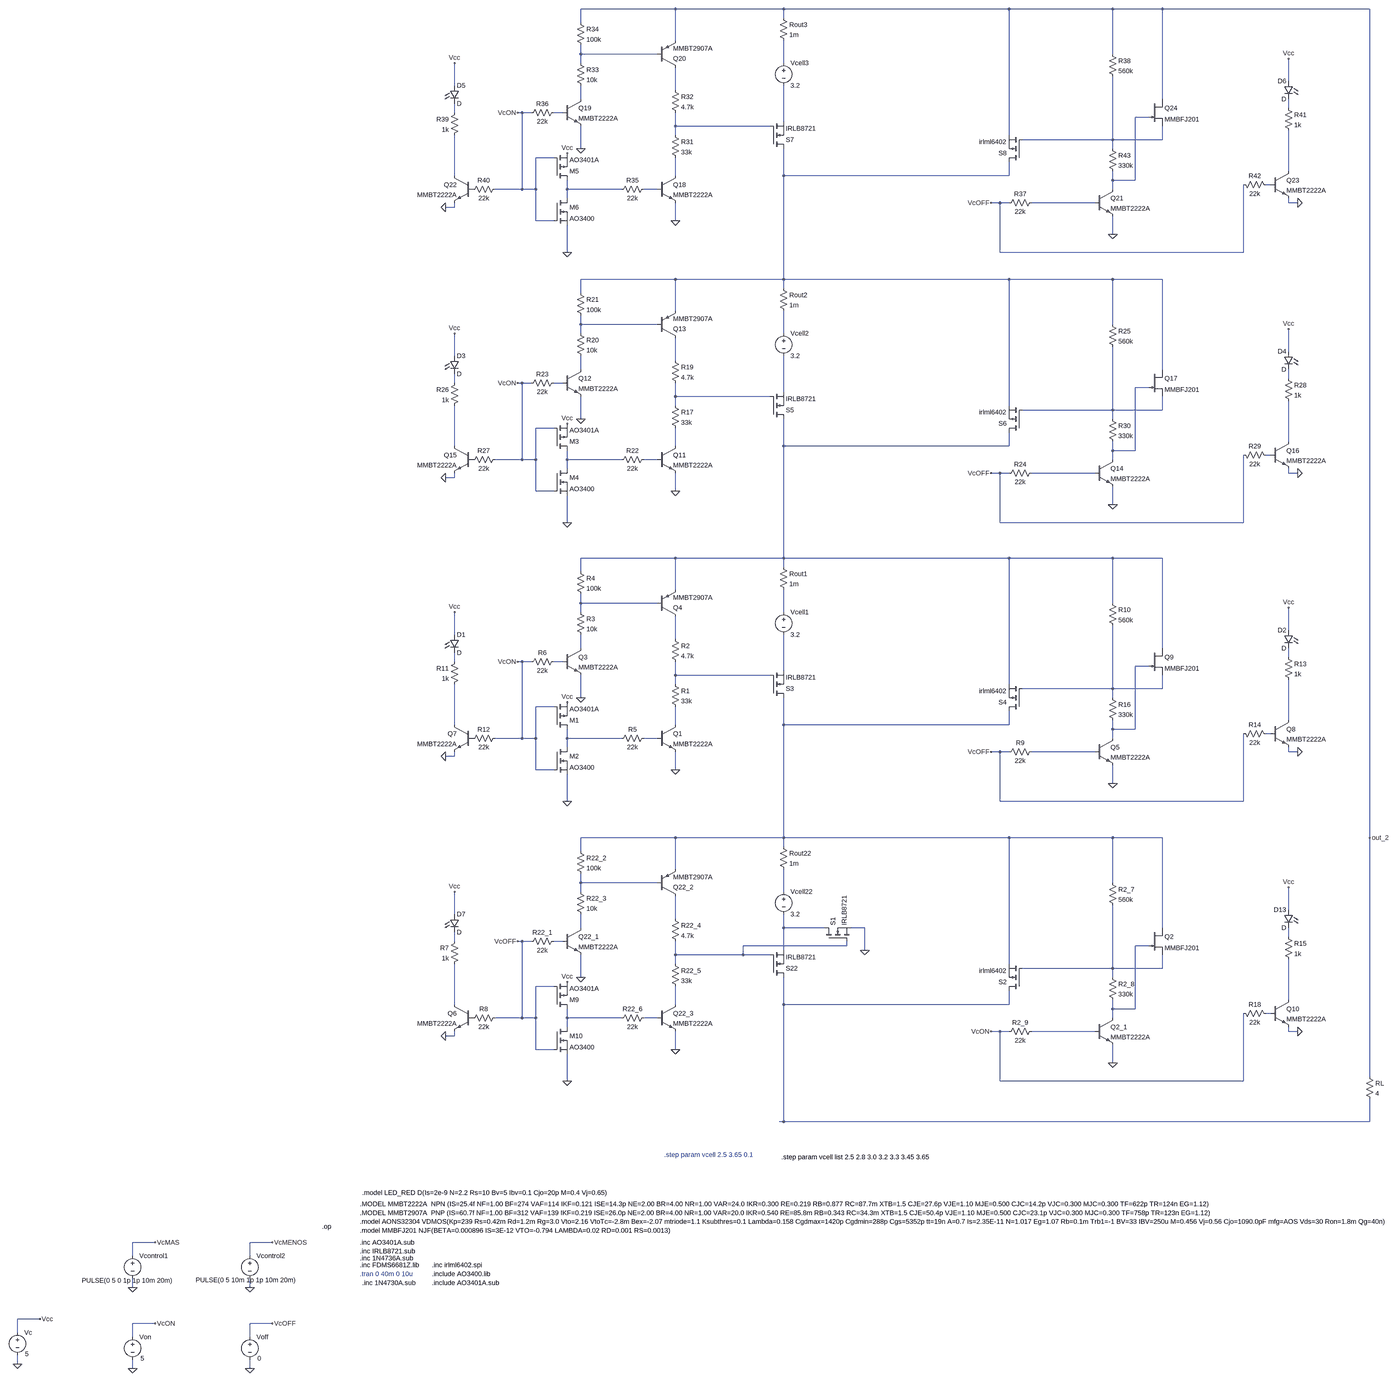
[diagram p0: schematic Testeo de cell_neg.asc, whole sheet]
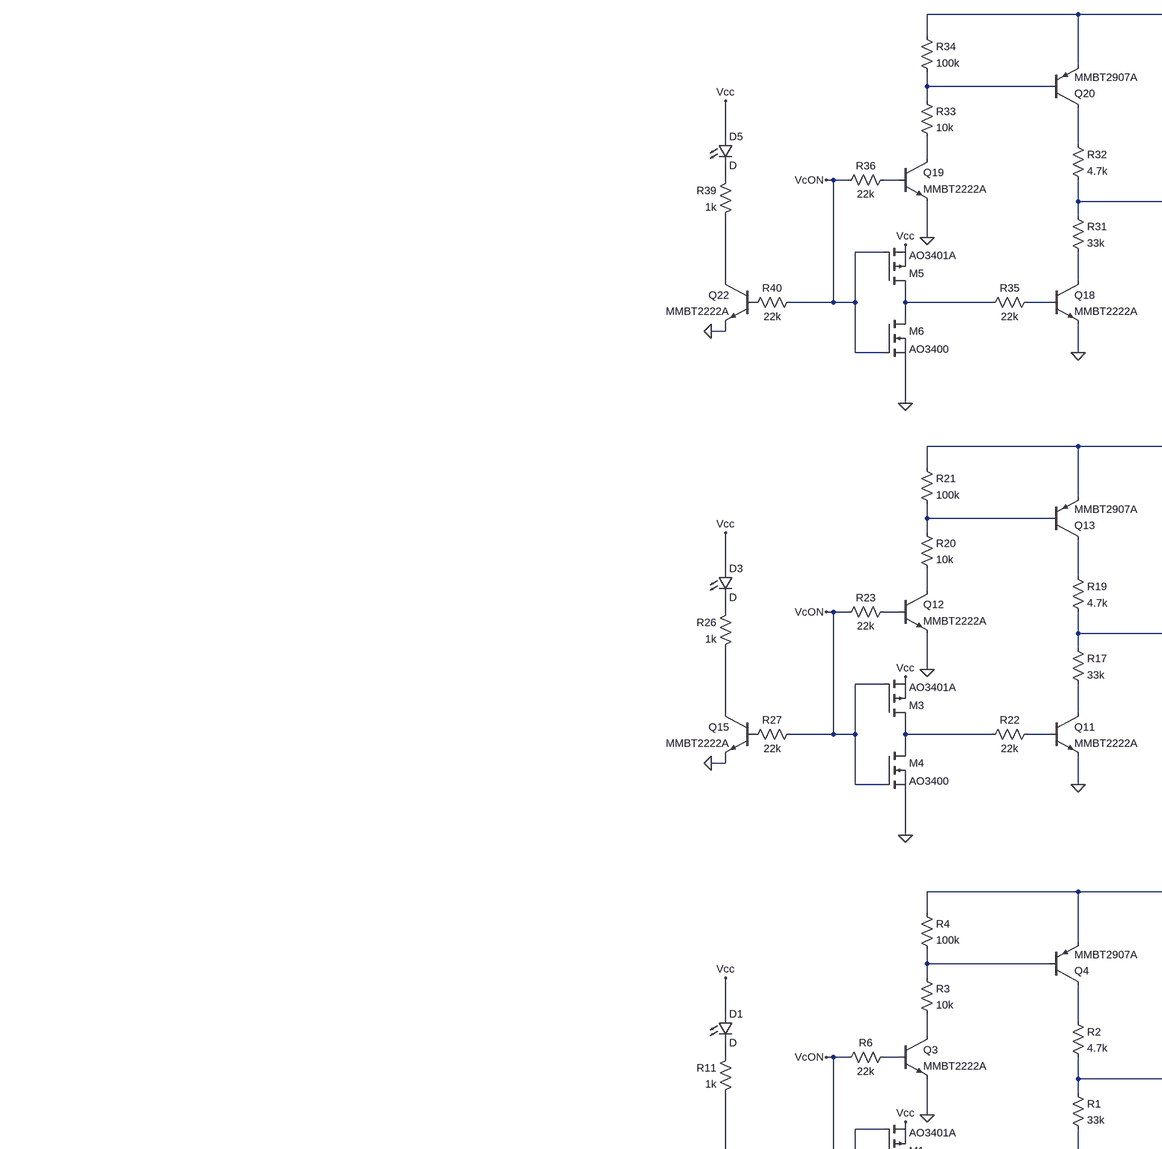
[diagram p1: schematic Testeo de cell_neg.asc, part, row 1 of 2, column 1 of 2]
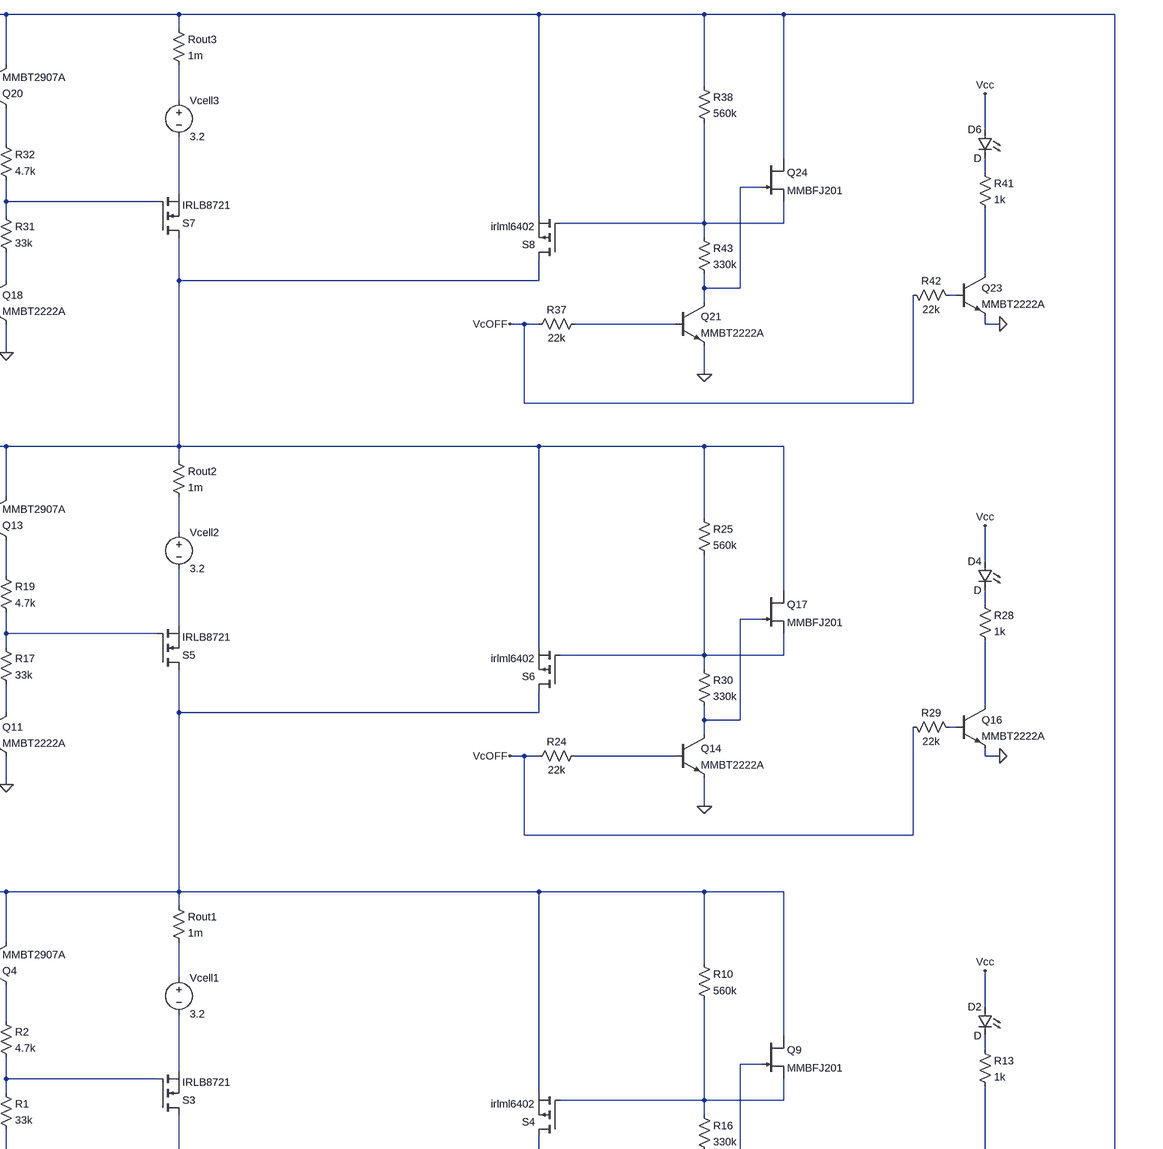
[diagram p2: schematic Testeo de cell_neg.asc, part, row 1 of 2, column 2 of 2]
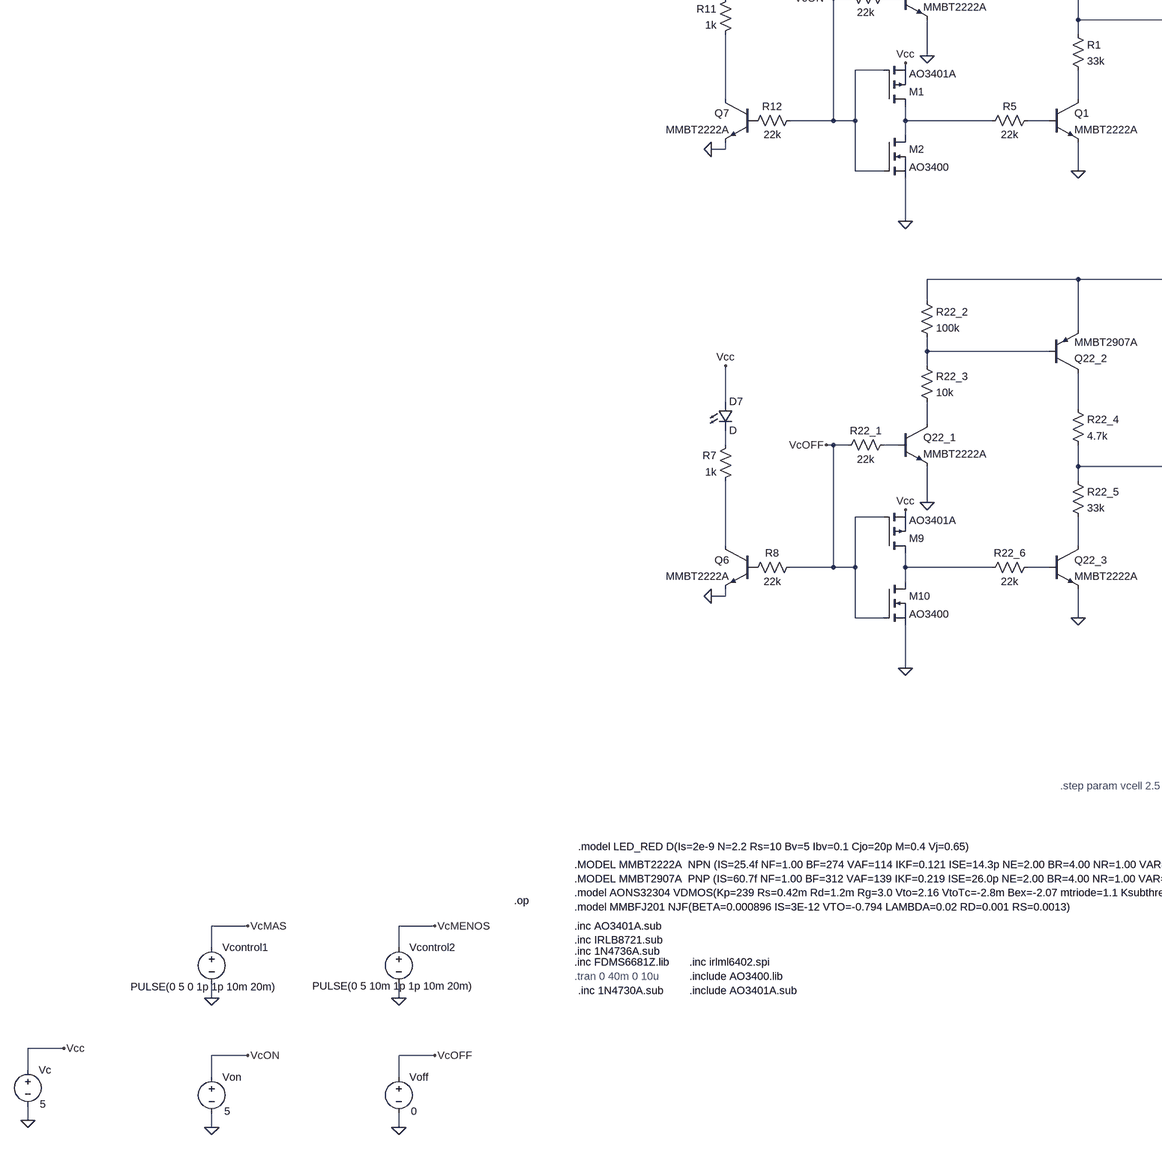
[diagram p3: schematic Testeo de cell_neg.asc, part, row 2 of 2, column 1 of 2]
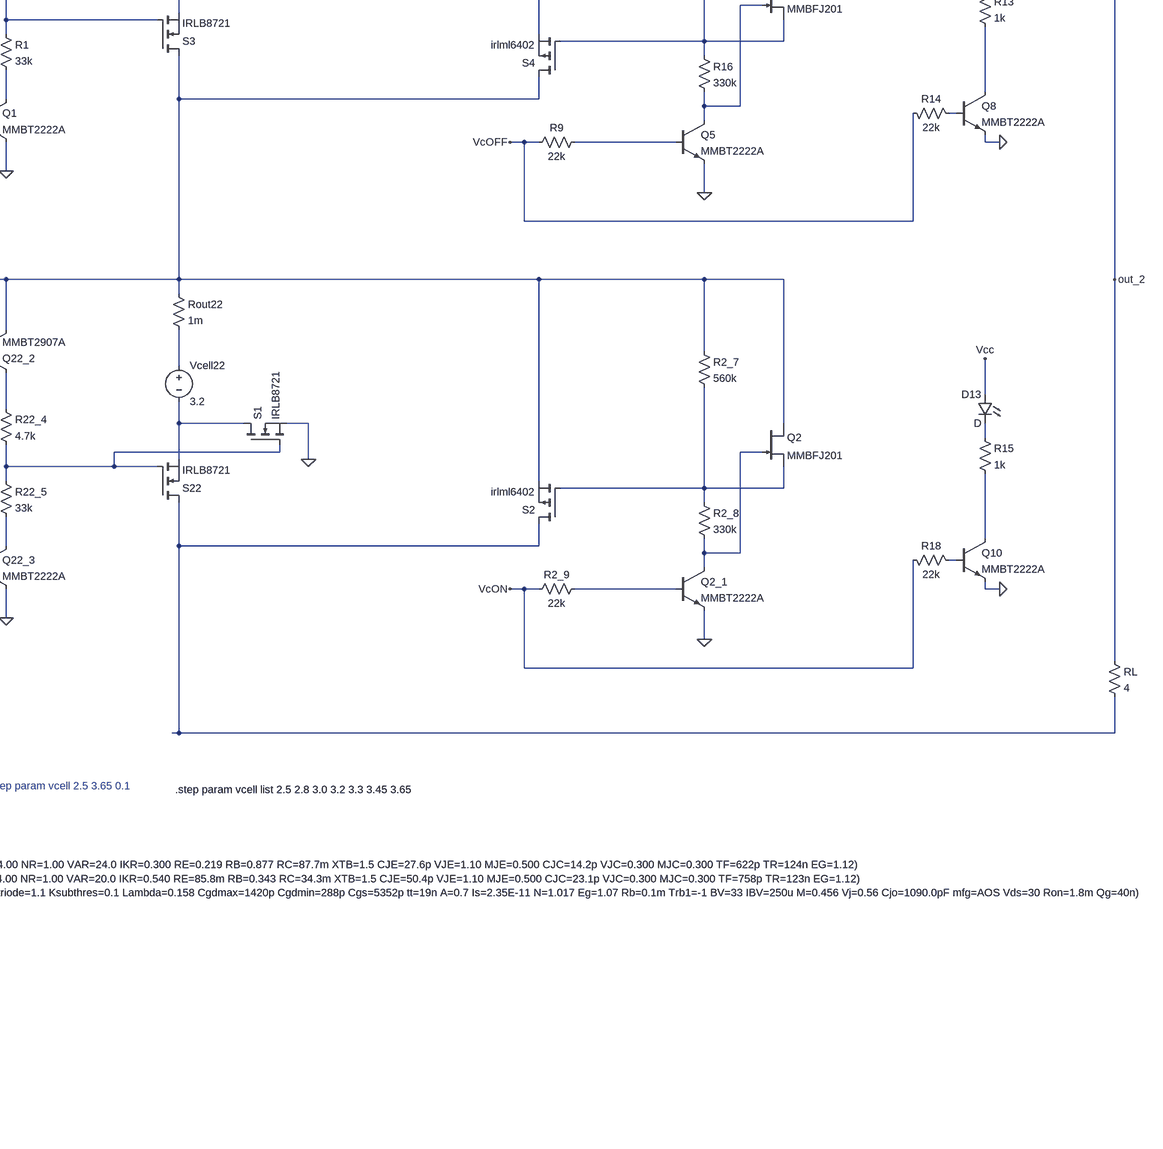
[diagram p4: schematic Testeo de cell_neg.asc, part, row 2 of 2, column 2 of 2]
Testeo de cell_neg.asc, the LTspice schematic file:
Version 4.1
SHEET 1 7672 2128
WIRE 896 -3664 560 -3664
WIRE 1280 -3664 896 -3664
WIRE 2080 -3664 1280 -3664
WIRE 2448 -3664 2080 -3664
WIRE 2624 -3664 2448 -3664
WIRE 3360 -3664 2624 -3664
WIRE 1280 -3632 1280 -3664
WIRE 560 -3616 560 -3664
WIRE 896 -3552 896 -3664
WIRE 560 -3504 560 -3536
WIRE 832 -3504 560 -3504
WIRE 2448 -3504 2448 -3664
WIRE 560 -3472 560 -3504
WIRE 1280 -3472 1280 -3552
WIRE 3072 -3408 3072 -3488
WIRE 112 -3392 112 -3472
WIRE 896 -3376 896 -3456
WIRE 560 -3344 560 -3392
WIRE 2624 -3344 2624 -3664
WIRE 3072 -3312 3072 -3344
WIRE 112 -3296 112 -3328
WIRE 352 -3296 336 -3296
WIRE 384 -3296 352 -3296
WIRE 496 -3296 464 -3296
WIRE 2576 -3280 2528 -3280
WIRE 1280 -3264 1280 -3392
WIRE 896 -3248 896 -3296
WIRE 1232 -3248 896 -3248
WIRE 896 -3216 896 -3248
WIRE 2080 -3216 2080 -3664
WIRE 2448 -3200 2448 -3424
WIRE 2448 -3200 2128 -3200
WIRE 2624 -3200 2624 -3248
WIRE 2624 -3200 2448 -3200
WIRE 560 -3168 560 -3248
WIRE 2448 -3168 2448 -3200
WIRE 464 -3136 400 -3136
WIRE 3072 -3088 3072 -3232
WIRE 112 -3072 112 -3216
WIRE 896 -3072 896 -3136
WIRE 1280 -3072 1280 -3168
WIRE 2080 -3072 2080 -3120
WIRE 2080 -3072 1280 -3072
WIRE 2448 -3056 2448 -3088
WIRE 2528 -3056 2528 -3280
WIRE 2528 -3056 2448 -3056
WIRE 3008 -3040 2992 -3040
WIRE 352 -3024 352 -3296
WIRE 352 -3024 256 -3024
WIRE 400 -3024 400 -3136
WIRE 400 -3024 352 -3024
WIRE 512 -3024 512 -3056
WIRE 704 -3024 512 -3024
WIRE 832 -3024 784 -3024
WIRE 2448 -3024 2448 -3056
WIRE 512 -2992 512 -3024
WIRE 2048 -2976 2016 -2976
WIRE 2080 -2976 2048 -2976
WIRE 2384 -2976 2160 -2976
WIRE 3072 -2976 3072 -2992
WIRE 3104 -2976 3072 -2976
WIRE 112 -2960 112 -2976
WIRE 112 -2960 80 -2960
WIRE 400 -2912 400 -3024
WIRE 464 -2912 400 -2912
WIRE 896 -2912 896 -2976
WIRE 2448 -2864 2448 -2928
WIRE 512 -2800 512 -2896
WIRE 2048 -2800 2048 -2976
WIRE 2912 -2800 2912 -3040
WIRE 2912 -2800 2048 -2800
WIRE 896 -2704 560 -2704
WIRE 1280 -2704 1280 -3072
WIRE 1280 -2704 896 -2704
WIRE 2080 -2704 1280 -2704
WIRE 2448 -2704 2080 -2704
WIRE 2624 -2704 2448 -2704
WIRE 1280 -2672 1280 -2704
WIRE 560 -2656 560 -2704
WIRE 896 -2592 896 -2704
WIRE 560 -2544 560 -2576
WIRE 832 -2544 560 -2544
WIRE 2448 -2544 2448 -2704
WIRE 560 -2512 560 -2544
WIRE 1280 -2512 1280 -2592
WIRE 3072 -2448 3072 -2528
WIRE 112 -2432 112 -2512
WIRE 896 -2416 896 -2496
WIRE 560 -2384 560 -2432
WIRE 2624 -2384 2624 -2704
WIRE 3072 -2352 3072 -2384
WIRE 112 -2336 112 -2368
WIRE 352 -2336 336 -2336
WIRE 384 -2336 352 -2336
WIRE 496 -2336 464 -2336
WIRE 2576 -2320 2528 -2320
WIRE 1280 -2304 1280 -2432
WIRE 896 -2288 896 -2336
WIRE 1232 -2288 896 -2288
WIRE 896 -2256 896 -2288
WIRE 2080 -2256 2080 -2704
WIRE 2448 -2240 2448 -2464
WIRE 2448 -2240 2128 -2240
WIRE 2624 -2240 2624 -2288
WIRE 2624 -2240 2448 -2240
WIRE 560 -2208 560 -2288
WIRE 2448 -2208 2448 -2240
WIRE 464 -2176 400 -2176
WIRE 3072 -2128 3072 -2272
WIRE 112 -2112 112 -2256
WIRE 896 -2112 896 -2176
WIRE 1280 -2112 1280 -2208
WIRE 2080 -2112 2080 -2160
WIRE 2080 -2112 1280 -2112
WIRE 2448 -2096 2448 -2128
WIRE 2528 -2096 2528 -2320
WIRE 2528 -2096 2448 -2096
WIRE 3008 -2080 2992 -2080
WIRE 352 -2064 352 -2336
WIRE 352 -2064 256 -2064
WIRE 400 -2064 400 -2176
WIRE 400 -2064 352 -2064
WIRE 512 -2064 512 -2096
WIRE 704 -2064 512 -2064
WIRE 832 -2064 784 -2064
WIRE 2448 -2064 2448 -2096
WIRE 512 -2032 512 -2064
WIRE 2048 -2016 2016 -2016
WIRE 2080 -2016 2048 -2016
WIRE 2384 -2016 2160 -2016
WIRE 3072 -2016 3072 -2032
WIRE 3104 -2016 3072 -2016
WIRE 112 -2000 112 -2016
WIRE 112 -2000 80 -2000
WIRE 400 -1952 400 -2064
WIRE 464 -1952 400 -1952
WIRE 896 -1952 896 -2016
WIRE 2448 -1904 2448 -1968
WIRE 512 -1840 512 -1936
WIRE 2048 -1840 2048 -2016
WIRE 2912 -1840 2912 -2080
WIRE 2912 -1840 2048 -1840
WIRE 896 -1696 560 -1696
WIRE 1280 -1696 1280 -2112
WIRE 1280 -1696 896 -1696
WIRE 2080 -1696 1280 -1696
WIRE 2448 -1696 2080 -1696
WIRE 2624 -1696 2448 -1696
WIRE 1280 -1664 1280 -1696
WIRE 560 -1648 560 -1696
WIRE 896 -1584 896 -1696
WIRE 560 -1536 560 -1568
WIRE 832 -1536 560 -1536
WIRE 2448 -1536 2448 -1696
WIRE 560 -1504 560 -1536
WIRE 1280 -1504 1280 -1584
WIRE 3072 -1440 3072 -1520
WIRE 112 -1424 112 -1504
WIRE 896 -1408 896 -1488
WIRE 560 -1376 560 -1424
WIRE 2624 -1376 2624 -1696
WIRE 3072 -1344 3072 -1376
WIRE 112 -1328 112 -1360
WIRE 352 -1328 336 -1328
WIRE 384 -1328 352 -1328
WIRE 496 -1328 464 -1328
WIRE 2576 -1312 2528 -1312
WIRE 1280 -1296 1280 -1424
WIRE 896 -1280 896 -1328
WIRE 1232 -1280 896 -1280
WIRE 896 -1248 896 -1280
WIRE 2080 -1248 2080 -1696
WIRE 2448 -1232 2448 -1456
WIRE 2448 -1232 2128 -1232
WIRE 2624 -1232 2624 -1280
WIRE 2624 -1232 2448 -1232
WIRE 560 -1200 560 -1280
WIRE 2448 -1200 2448 -1232
WIRE 464 -1168 400 -1168
WIRE 3072 -1120 3072 -1264
WIRE 112 -1104 112 -1248
WIRE 896 -1104 896 -1168
WIRE 1280 -1104 1280 -1200
WIRE 2080 -1104 2080 -1152
WIRE 2080 -1104 1280 -1104
WIRE 2448 -1088 2448 -1120
WIRE 2528 -1088 2528 -1312
WIRE 2528 -1088 2448 -1088
WIRE 3008 -1072 2992 -1072
WIRE 352 -1056 352 -1328
WIRE 352 -1056 256 -1056
WIRE 400 -1056 400 -1168
WIRE 400 -1056 352 -1056
WIRE 512 -1056 512 -1088
WIRE 704 -1056 512 -1056
WIRE 832 -1056 784 -1056
WIRE 2448 -1056 2448 -1088
WIRE 512 -1024 512 -1056
WIRE 2048 -1008 2016 -1008
WIRE 2080 -1008 2048 -1008
WIRE 2384 -1008 2160 -1008
WIRE 3072 -1008 3072 -1024
WIRE 3104 -1008 3072 -1008
WIRE 112 -992 112 -1008
WIRE 112 -992 80 -992
WIRE 400 -944 400 -1056
WIRE 464 -944 400 -944
WIRE 896 -944 896 -1008
WIRE 2448 -896 2448 -960
WIRE 512 -832 512 -928
WIRE 2048 -832 2048 -1008
WIRE 2912 -832 2912 -1072
WIRE 2912 -832 2048 -832
WIRE 896 -688 560 -688
WIRE 1280 -688 1280 -1104
WIRE 1280 -688 896 -688
WIRE 2080 -688 1280 -688
WIRE 2448 -688 2080 -688
WIRE 2624 -688 2448 -688
WIRE 3360 -688 3360 -3664
WIRE 1280 -656 1280 -688
WIRE 560 -640 560 -688
WIRE 896 -576 896 -688
WIRE 560 -528 560 -560
WIRE 832 -528 560 -528
WIRE 2448 -528 2448 -688
WIRE 560 -496 560 -528
WIRE 1280 -496 1280 -576
WIRE 3072 -432 3072 -512
WIRE 112 -416 112 -496
WIRE 896 -400 896 -480
WIRE 560 -368 560 -416
WIRE 1280 -368 1280 -416
WIRE 1424 -368 1280 -368
WIRE 1568 -368 1520 -368
WIRE 2624 -368 2624 -688
WIRE 3072 -336 3072 -368
WIRE 112 -320 112 -352
WIRE 352 -320 336 -320
WIRE 384 -320 352 -320
WIRE 496 -320 464 -320
WIRE 1504 -304 1504 -320
WIRE 1504 -304 1136 -304
WIRE 2576 -304 2528 -304
WIRE 1280 -288 1280 -368
WIRE 1568 -288 1568 -368
WIRE 896 -272 896 -320
WIRE 1136 -272 1136 -304
WIRE 1136 -272 896 -272
WIRE 1232 -272 1136 -272
WIRE 896 -240 896 -272
WIRE 2080 -240 2080 -688
WIRE 2448 -224 2448 -448
WIRE 2448 -224 2128 -224
WIRE 2624 -224 2624 -272
WIRE 2624 -224 2448 -224
WIRE 560 -192 560 -272
WIRE 2448 -192 2448 -224
WIRE 464 -160 400 -160
WIRE 3072 -112 3072 -256
WIRE 112 -96 112 -240
WIRE 896 -96 896 -160
WIRE 1280 -96 1280 -192
WIRE 2080 -96 2080 -144
WIRE 2080 -96 1280 -96
WIRE 2448 -80 2448 -112
WIRE 2528 -80 2528 -304
WIRE 2528 -80 2448 -80
WIRE 3008 -64 2992 -64
WIRE 352 -48 352 -320
WIRE 352 -48 256 -48
WIRE 400 -48 400 -160
WIRE 400 -48 352 -48
WIRE 512 -48 512 -80
WIRE 704 -48 512 -48
WIRE 832 -48 784 -48
WIRE 2448 -48 2448 -80
WIRE 512 -16 512 -48
WIRE 2048 0 2016 0
WIRE 2080 0 2048 0
WIRE 2384 0 2160 0
WIRE 3072 0 3072 -16
WIRE 3104 0 3072 0
WIRE 112 16 112 0
WIRE 112 16 80 16
WIRE 400 64 400 -48
WIRE 464 64 400 64
WIRE 896 64 896 0
WIRE 2448 112 2448 48
WIRE 3360 160 3360 -688
WIRE 512 176 512 80
WIRE 2048 176 2048 0
WIRE 2912 176 2912 -64
WIRE 2912 176 2048 176
WIRE 1280 320 1280 -96
WIRE 1280 320 1264 320
WIRE 3360 320 3360 240
WIRE 3360 320 1280 320
WIRE -1072 1024 -1152 1024
WIRE -656 1024 -736 1024
WIRE -1152 1072 -1152 1024
WIRE -736 1072 -736 1024
WIRE -1152 1184 -1152 1152
WIRE -736 1184 -736 1152
WIRE -1504 1296 -1584 1296
WIRE -1072 1312 -1152 1312
WIRE -656 1312 -736 1312
WIRE -1584 1344 -1584 1296
WIRE -1152 1360 -1152 1312
WIRE -736 1360 -736 1312
WIRE -1584 1456 -1584 1424
WIRE -1152 1472 -1152 1440
WIRE -736 1472 -736 1440
FLAG 560 -192 0
FLAG 896 64 0
FLAG -1152 1184 0
FLAG -736 1184 0
FLAG -1072 1024 VcMAS
FLAG -656 1024 VcMENOS
FLAG -736 1472 0
FLAG -656 1312 VcOFF
FLAG -1152 1472 0
FLAG -1072 1312 VcON
FLAG 336 -320 VcOFF
FLAG 2448 112 0
FLAG 2016 0 VcON
FLAG 3360 -688 out_2
FLAG 80 16 0
FLAG 3104 0 0
FLAG 112 -496 Vcc
FLAG 3072 -512 Vcc
FLAG -1584 1456 0
FLAG -1504 1296 Vcc
FLAG 512 176 0
FLAG 512 -176 Vcc
FLAG 1568 -288 0
FLAG 560 -1200 0
FLAG 896 -944 0
FLAG 336 -1328 VcON
FLAG 2448 -896 0
FLAG 2016 -1008 VcOFF
FLAG 80 -992 0
FLAG 3104 -1008 0
FLAG 112 -1504 Vcc
FLAG 3072 -1520 Vcc
FLAG 512 -832 0
FLAG 512 -1184 Vcc
FLAG 560 -2208 0
FLAG 896 -1952 0
FLAG 336 -2336 VcON
FLAG 2448 -1904 0
FLAG 2016 -2016 VcOFF
FLAG 80 -2000 0
FLAG 3104 -2016 0
FLAG 112 -2512 Vcc
FLAG 3072 -2528 Vcc
FLAG 512 -1840 0
FLAG 512 -2192 Vcc
FLAG 560 -3168 0
FLAG 896 -2912 0
FLAG 336 -3296 VcON
FLAG 2448 -2864 0
FLAG 2016 -2976 VcOFF
FLAG 80 -2960 0
FLAG 3104 -2976 0
FLAG 112 -3472 Vcc
FLAG 3072 -3488 Vcc
FLAG 512 -2800 0
FLAG 512 -3152 Vcc
SYMBOL npn 832 -96 R0
SYMATTR InstName Q22_3
SYMATTR Value MMBT2222A
SYMBOL res 880 -256 R0
SYMATTR InstName R22_5
SYMATTR Value 33k
SYMBOL res 880 -416 R0
SYMATTR InstName R22_4
SYMATTR Value 4.7k
SYMBOL npn 496 -368 R0
SYMATTR InstName Q22_1
SYMATTR Value MMBT2222A
SYMBOL res 544 -512 R0
SYMATTR InstName R22_3
SYMATTR Value 10k
SYMBOL res 544 -656 R0
SYMATTR InstName R22_2
SYMATTR Value 100k
SYMBOL res 800 -64 R90
WINDOW 0 0 56 VBottom 2
WINDOW 3 32 56 VTop 2
SYMATTR InstName R22_6
SYMATTR Value 22k
SYMBOL voltage 1280 -512 R0
WINDOW 123 0 0 Left 0
WINDOW 39 0 0 Left 0
SYMATTR InstName Vcell22
SYMATTR Value 3.2
SYMBOL pnp 832 -480 M180
SYMATTR InstName Q22_2
SYMATTR Value MMBT2907A
SYMBOL nmos 1232 -192 M180
SYMATTR InstName S22
SYMATTR Value IRLB8721
SYMATTR Prefix X
SYMBOL voltage -1152 1056 R0
WINDOW 3 -180 103 Left 2
WINDOW 123 0 0 Left 0
WINDOW 39 0 0 Left 0
SYMATTR Value PULSE(0 5 0 1p 1p 10m 20m)
SYMATTR InstName Vcontrol1
SYMBOL voltage -736 1056 R0
WINDOW 3 -192 102 Left 2
WINDOW 123 0 0 Left 0
WINDOW 39 0 0 Left 0
SYMATTR Value PULSE(0 5 10m 1p 1p 10m 20m)
SYMATTR InstName Vcontrol2
SYMBOL voltage -736 1344 R0
WINDOW 3 27 92 Left 2
WINDOW 123 0 0 Left 0
WINDOW 39 0 0 Left 0
SYMATTR Value 0
SYMATTR InstName Voff
SYMBOL voltage -1152 1344 R0
WINDOW 3 28 92 Left 2
WINDOW 123 0 0 Left 0
WINDOW 39 0 0 Left 0
SYMATTR Value 5
SYMATTR InstName Von
SYMBOL res 480 -336 R90
WINDOW 0 0 56 VBottom 2
WINDOW 3 32 56 VTop 2
SYMATTR InstName R22_1
SYMATTR Value 22k
SYMBOL res 1264 -672 R0
SYMATTR InstName Rout22
SYMATTR Value 1m
SYMBOL npn 2384 -48 R0
SYMATTR InstName Q2_1
SYMATTR Value MMBT2222A
SYMBOL res 2176 -16 R90
WINDOW 0 0 56 VBottom 2
WINDOW 3 32 56 VTop 2
SYMATTR InstName R2_9
SYMATTR Value 22k
SYMBOL res 2432 -544 R0
SYMATTR InstName R2_7
SYMATTR Value 560k
SYMBOL pmos 2128 -144 R180
SYMATTR InstName S2
SYMATTR Value irlml6402
SYMATTR Prefix X
SYMBOL npn 176 -96 M0
SYMATTR InstName Q6
SYMATTR Value MMBT2222A
SYMBOL res 128 -336 M0
SYMATTR InstName R7
SYMATTR Value 1k
SYMBOL res 272 -64 R90
WINDOW 0 0 56 VBottom 2
WINDOW 3 32 56 VTop 2
SYMATTR InstName R8
SYMATTR Value 22k
SYMBOL LED 96 -416 R0
SYMATTR InstName D7
SYMBOL npn 3008 -112 R0
SYMATTR InstName Q10
SYMATTR Value MMBT2222A
SYMBOL res 3056 -352 R0
SYMATTR InstName R15
SYMATTR Value 1k
SYMBOL res 2896 -80 M90
WINDOW 0 0 56 VBottom 2
WINDOW 3 32 56 VTop 2
SYMATTR InstName R18
SYMATTR Value 22k
SYMBOL LED 3088 -432 M0
SYMATTR InstName D13
SYMBOL res 2432 -208 R0
SYMATTR InstName R2_8
SYMATTR Value 330k
SYMBOL res 3344 144 R0
SYMATTR InstName RL
SYMATTR Value 4
SYMBOL voltage -1584 1328 R0
WINDOW 3 27 92 Left 2
WINDOW 123 0 0 Left 0
WINDOW 39 0 0 Left 0
SYMATTR Value 5
SYMATTR InstName Vc
SYMBOL pmos 464 -80 M180
SYMATTR InstName M9
SYMATTR Value AO3401A
SYMATTR Prefix X
SYMBOL nmos 464 -16 R0
SYMATTR InstName M10
SYMATTR Value AO3400
SYMATTR Prefix X
SYMBOL njf 2576 -368 R0
SYMATTR InstName Q2
SYMATTR Value MMBFJ201
SYMBOL nmos 1424 -320 R270
SYMATTR InstName S1
SYMATTR Value IRLB8721
SYMATTR Prefix X
SYMBOL npn 832 -1104 R0
SYMATTR InstName Q1
SYMATTR Value MMBT2222A
SYMBOL res 880 -1264 R0
SYMATTR InstName R1
SYMATTR Value 33k
SYMBOL res 880 -1424 R0
SYMATTR InstName R2
SYMATTR Value 4.7k
SYMBOL npn 496 -1376 R0
SYMATTR InstName Q3
SYMATTR Value MMBT2222A
SYMBOL res 544 -1520 R0
SYMATTR InstName R3
SYMATTR Value 10k
SYMBOL res 544 -1664 R0
SYMATTR InstName R4
SYMATTR Value 100k
SYMBOL res 800 -1072 R90
WINDOW 0 0 56 VBottom 2
WINDOW 3 32 56 VTop 2
SYMATTR InstName R5
SYMATTR Value 22k
SYMBOL voltage 1280 -1520 R0
WINDOW 123 0 0 Left 0
WINDOW 39 0 0 Left 0
SYMATTR InstName Vcell1
SYMATTR Value 3.2
SYMBOL pnp 832 -1488 M180
SYMATTR InstName Q4
SYMATTR Value MMBT2907A
SYMBOL nmos 1232 -1200 M180
SYMATTR InstName S3
SYMATTR Value IRLB8721
SYMATTR Prefix X
SYMBOL res 480 -1344 R90
WINDOW 0 0 56 VBottom 2
WINDOW 3 32 56 VTop 2
SYMATTR InstName R6
SYMATTR Value 22k
SYMBOL res 1264 -1680 R0
SYMATTR InstName Rout1
SYMATTR Value 1m
SYMBOL npn 2384 -1056 R0
SYMATTR InstName Q5
SYMATTR Value MMBT2222A
SYMBOL res 2176 -1024 R90
WINDOW 0 0 56 VBottom 2
WINDOW 3 32 56 VTop 2
SYMATTR InstName R9
SYMATTR Value 22k
SYMBOL res 2432 -1552 R0
SYMATTR InstName R10
SYMATTR Value 560k
SYMBOL pmos 2128 -1152 R180
SYMATTR InstName S4
SYMATTR Value irlml6402
SYMATTR Prefix X
SYMBOL npn 176 -1104 M0
SYMATTR InstName Q7
SYMATTR Value MMBT2222A
SYMBOL res 128 -1344 M0
SYMATTR InstName R11
SYMATTR Value 1k
SYMBOL res 272 -1072 R90
WINDOW 0 0 56 VBottom 2
WINDOW 3 32 56 VTop 2
SYMATTR InstName R12
SYMATTR Value 22k
SYMBOL LED 96 -1424 R0
SYMATTR InstName D1
SYMBOL npn 3008 -1120 R0
SYMATTR InstName Q8
SYMATTR Value MMBT2222A
SYMBOL res 3056 -1360 R0
SYMATTR InstName R13
SYMATTR Value 1k
SYMBOL res 2896 -1088 M90
WINDOW 0 0 56 VBottom 2
WINDOW 3 32 56 VTop 2
SYMATTR InstName R14
SYMATTR Value 22k
SYMBOL LED 3088 -1440 M0
SYMATTR InstName D2
SYMBOL res 2432 -1216 R0
SYMATTR InstName R16
SYMATTR Value 330k
SYMBOL pmos 464 -1088 M180
SYMATTR InstName M1
SYMATTR Value AO3401A
SYMATTR Prefix X
SYMBOL nmos 464 -1024 R0
SYMATTR InstName M2
SYMATTR Value AO3400
SYMATTR Prefix X
SYMBOL njf 2576 -1376 R0
SYMATTR InstName Q9
SYMATTR Value MMBFJ201
SYMBOL npn 832 -2112 R0
SYMATTR InstName Q11
SYMATTR Value MMBT2222A
SYMBOL res 880 -2272 R0
SYMATTR InstName R17
SYMATTR Value 33k
SYMBOL res 880 -2432 R0
SYMATTR InstName R19
SYMATTR Value 4.7k
SYMBOL npn 496 -2384 R0
SYMATTR InstName Q12
SYMATTR Value MMBT2222A
SYMBOL res 544 -2528 R0
SYMATTR InstName R20
SYMATTR Value 10k
SYMBOL res 544 -2672 R0
SYMATTR InstName R21
SYMATTR Value 100k
SYMBOL res 800 -2080 R90
WINDOW 0 0 56 VBottom 2
WINDOW 3 32 56 VTop 2
SYMATTR InstName R22
SYMATTR Value 22k
SYMBOL voltage 1280 -2528 R0
WINDOW 123 0 0 Left 0
WINDOW 39 0 0 Left 0
SYMATTR InstName Vcell2
SYMATTR Value 3.2
SYMBOL pnp 832 -2496 M180
SYMATTR InstName Q13
SYMATTR Value MMBT2907A
SYMBOL nmos 1232 -2208 M180
SYMATTR InstName S5
SYMATTR Value IRLB8721
SYMATTR Prefix X
SYMBOL res 480 -2352 R90
WINDOW 0 0 56 VBottom 2
WINDOW 3 32 56 VTop 2
SYMATTR InstName R23
SYMATTR Value 22k
SYMBOL res 1264 -2688 R0
SYMATTR InstName Rout2
SYMATTR Value 1m
SYMBOL npn 2384 -2064 R0
SYMATTR InstName Q14
SYMATTR Value MMBT2222A
SYMBOL res 2176 -2032 R90
WINDOW 0 0 56 VBottom 2
WINDOW 3 32 56 VTop 2
SYMATTR InstName R24
SYMATTR Value 22k
SYMBOL res 2432 -2560 R0
SYMATTR InstName R25
SYMATTR Value 560k
SYMBOL pmos 2128 -2160 R180
SYMATTR InstName S6
SYMATTR Value irlml6402
SYMATTR Prefix X
SYMBOL npn 176 -2112 M0
SYMATTR InstName Q15
SYMATTR Value MMBT2222A
SYMBOL res 128 -2352 M0
SYMATTR InstName R26
SYMATTR Value 1k
SYMBOL res 272 -2080 R90
WINDOW 0 0 56 VBottom 2
WINDOW 3 32 56 VTop 2
SYMATTR InstName R27
SYMATTR Value 22k
SYMBOL LED 96 -2432 R0
SYMATTR InstName D3
SYMBOL npn 3008 -2128 R0
SYMATTR InstName Q16
SYMATTR Value MMBT2222A
SYMBOL res 3056 -2368 R0
SYMATTR InstName R28
SYMATTR Value 1k
SYMBOL res 2896 -2096 M90
WINDOW 0 0 56 VBottom 2
WINDOW 3 32 56 VTop 2
SYMATTR InstName R29
SYMATTR Value 22k
SYMBOL LED 3088 -2448 M0
SYMATTR InstName D4
SYMBOL res 2432 -2224 R0
SYMATTR InstName R30
SYMATTR Value 330k
SYMBOL pmos 464 -2096 M180
SYMATTR InstName M3
SYMATTR Value AO3401A
SYMATTR Prefix X
SYMBOL nmos 464 -2032 R0
SYMATTR InstName M4
SYMATTR Value AO3400
SYMATTR Prefix X
SYMBOL njf 2576 -2384 R0
SYMATTR InstName Q17
SYMATTR Value MMBFJ201
SYMBOL npn 832 -3072 R0
SYMATTR InstName Q18
SYMATTR Value MMBT2222A
SYMBOL res 880 -3232 R0
SYMATTR InstName R31
SYMATTR Value 33k
SYMBOL res 880 -3392 R0
SYMATTR InstName R32
SYMATTR Value 4.7k
SYMBOL npn 496 -3344 R0
SYMATTR InstName Q19
SYMATTR Value MMBT2222A
SYMBOL res 544 -3488 R0
SYMATTR InstName R33
SYMATTR Value 10k
SYMBOL res 544 -3632 R0
SYMATTR InstName R34
SYMATTR Value 100k
SYMBOL res 800 -3040 R90
WINDOW 0 0 56 VBottom 2
WINDOW 3 32 56 VTop 2
SYMATTR InstName R35
SYMATTR Value 22k
SYMBOL voltage 1280 -3488 R0
WINDOW 123 0 0 Left 0
WINDOW 39 0 0 Left 0
SYMATTR InstName Vcell3
SYMATTR Value 3.2
SYMBOL pnp 832 -3456 M180
SYMATTR InstName Q20
SYMATTR Value MMBT2907A
SYMBOL nmos 1232 -3168 M180
SYMATTR InstName S7
SYMATTR Value IRLB8721
SYMATTR Prefix X
SYMBOL res 480 -3312 R90
WINDOW 0 0 56 VBottom 2
WINDOW 3 32 56 VTop 2
SYMATTR InstName R36
SYMATTR Value 22k
SYMBOL res 1264 -3648 R0
SYMATTR InstName Rout3
SYMATTR Value 1m
SYMBOL npn 2384 -3024 R0
SYMATTR InstName Q21
SYMATTR Value MMBT2222A
SYMBOL res 2176 -2992 R90
WINDOW 0 0 56 VBottom 2
WINDOW 3 32 56 VTop 2
SYMATTR InstName R37
SYMATTR Value 22k
SYMBOL res 2432 -3520 R0
SYMATTR InstName R38
SYMATTR Value 560k
SYMBOL pmos 2128 -3120 R180
SYMATTR InstName S8
SYMATTR Value irlml6402
SYMATTR Prefix X
SYMBOL npn 176 -3072 M0
SYMATTR InstName Q22
SYMATTR Value MMBT2222A
SYMBOL res 128 -3312 M0
SYMATTR InstName R39
SYMATTR Value 1k
SYMBOL res 272 -3040 R90
WINDOW 0 0 56 VBottom 2
WINDOW 3 32 56 VTop 2
SYMATTR InstName R40
SYMATTR Value 22k
SYMBOL LED 96 -3392 R0
SYMATTR InstName D5
SYMBOL npn 3008 -3088 R0
SYMATTR InstName Q23
SYMATTR Value MMBT2222A
SYMBOL res 3056 -3328 R0
SYMATTR InstName R41
SYMATTR Value 1k
SYMBOL res 2896 -3056 M90
WINDOW 0 0 56 VBottom 2
WINDOW 3 32 56 VTop 2
SYMATTR InstName R42
SYMATTR Value 22k
SYMBOL LED 3088 -3408 M0
SYMATTR InstName D6
SYMBOL res 2432 -3184 R0
SYMATTR InstName R43
SYMATTR Value 330k
SYMBOL pmos 464 -3056 M180
SYMATTR InstName M5
SYMATTR Value AO3401A
SYMATTR Prefix X
SYMBOL nmos 464 -2992 R0
SYMATTR InstName M6
SYMATTR Value AO3400
SYMATTR Prefix X
SYMBOL njf 2576 -3344 R0
SYMATTR InstName Q24
SYMATTR Value MMBFJ201
TEXT -224 1136 Left 2 ;.tran 0 40m 0 10u
TEXT -224 888 Left 2 !.MODEL MMBT2222A  NPN (IS=25.4f NF=1.00 BF=274 VAF=114 IKF=0.121 ISE=14.3p NE=2.00 BR=4.00 NR=1.00 VAR=24.0 IKR=0.300 RE=0.219 RB=0.877 RC=87.7m XTB=1.5 CJE=27.6p VJE=1.10 MJE=0.500 CJC=14.2p VJC=0.300 MJC=0.300 TF=622p TR=124n EG=1.12)\n.MODEL MMBT2907A  PNP (IS=60.7f NF=1.00 BF=312 VAF=139 IKF=0.219 ISE=26.0p NE=2.00 BR=4.00 NR=1.00 VAR=20.0 IKR=0.540 RE=85.8m RB=0.343 RC=34.3m XTB=1.5 CJE=50.4p VJE=1.10 MJE=0.500 CJC=23.1p VJC=0.300 MJC=0.300 TF=758p TR=123n EG=1.12)\n.model AONS32304 VDMOS(Kp=239 Rs=0.42m Rd=1.2m Rg=3.0 Vto=2.16 VtoTc=-2.8m Bex=-2.07 mtriode=1.1 Ksubthres=0.1 Lambda=0.158 Cgdmax=1420p Cgdmin=288p Cgs=5352p tt=19n A=0.7 Is=2.35E-11 N=1.017 Eg=1.07 Rb=0.1m Trb1=-1 BV=33 IBV=250u M=0.456 Vj=0.56 Cjo=1090.0pF mfg=AOS Vds=30 Ron=1.8m Qg=40n)\n.model MMBFJ201 NJF(BETA=0.000896 IS=3E-12 VTO=-0.794 LAMBDA=0.02 RD=0.001 RS=0.0013)
TEXT -224 1024 Left 2 !.inc AO3401A.sub\n.inc IRLB8721.sub
TEXT -224 1080 Left 2 !.inc 1N4736A.sub
TEXT -224 1104 Left 2 !.inc FDMS6681Z.lib
TEXT -216 1168 Left 2 !.inc 1N4730A.sub
TEXT -216 848 Left 2 !.model LED_RED D(Is=2e-9 N=2.2 Rs=10 Bv=5 Ibv=0.1 Cjo=20p M=0.4 Vj=0.65)
TEXT 32 1104 Left 2 !.inc irlml6402.spi
TEXT 32 1136 Left 2 !.include AO3400.lib
TEXT 32 1168 Left 2 !.include AO3401A.sub
TEXT -480 968 Left 2 !.op
TEXT 856 648 Left 2 ;.step param vcell 2.5 3.65 0.1
TEXT 1272 656 Left 2 !.step param vcell list 2.5 2.8 3.0 3.2 3.3 3.45 3.65

The netlist it stands for:
* Testeo de cell_neg.asc
Q22_3 N071 N075 0 0 MMBT2222A
R22_5 N066 N071 33k
R22_4 N060 N066 4.7k
Q22_1 N061 N065 0 0 MMBT2222A
R22_3 N058 N061 10k
R22_2 N053 N058 100k
R22_6 N075 N074 22k
Vcell22 N059 N062 3.2
Q22_2 N060 N058 N053 0 MMBT2907A
X§S22 N072 N066 N062 IRLB8721  ; pins D G S
Vcontrol1 VcMAS 0 PULSE(0 5 0 1p 1p 10m 20m)
Vcontrol2 VcMENOS 0 PULSE(0 5 10m 1p 1p 10m 20m)
Voff VcOFF 0 0
Von VcON 0 5
R22_1 N065 VcOFF 22k
Rout22 N053 N059 1m
Q2_1 N067 N076 0 0 MMBT2222A
R2_9 N076 VcON 22k
R2_7 N053 N068 560k
X§S2 N072 N068 N053 irlml6402  ; pins D G S
Q6 N070 P001 0 0 MMBT2222A
R7 N064 N070 1k
R8 VcOFF P001 22k
D7 Vcc N064 D
Q10 N069 N073 0 0 MMBT2222A
R15 N063 N069 1k
R18 VcON N073 22k
D13 Vcc N063 D
R2_8 N068 N067 330k
RL out_2 N072 4
Vc Vcc 0 5
X§M9 N074 VcOFF Vcc AO3401A  ; pins D G S
X§M10 N074 VcOFF 0 AO3400  ; pins D G S
J§Q2 N053 N067 N068 MMBFJ201
X§S1 N062 N066 0 IRLB8721  ; pins D G S
Q1 N052 N056 0 0 MMBT2222A
R1 N048 N052 33k
R2 N041 N048 4.7k
Q3 N042 N045 0 0 MMBT2222A
R3 N039 N042 10k
R4 N034 N039 100k
R5 N056 N055 22k
Vcell1 N040 N047 3.2
Q4 N041 N039 N034 0 MMBT2907A
X§S3 N053 N048 N047 IRLB8721  ; pins D G S
R6 N045 VcON 22k
Rout1 N034 N040 1m
Q5 N046 N057 0 0 MMBT2222A
R9 N057 VcOFF 22k
R10 N034 N049 560k
X§S4 N053 N049 N034 irlml6402  ; pins D G S
Q7 N051 P002 0 0 MMBT2222A
R11 N044 N051 1k
R12 VcON P002 22k
D1 Vcc N044 D
Q8 N050 N054 0 0 MMBT2222A
R13 N043 N050 1k
R14 VcOFF N054 22k
D2 Vcc N043 D
R16 N049 N046 330k
X§M1 N055 VcON Vcc AO3401A  ; pins D G S
X§M2 N055 VcON 0 AO3400  ; pins D G S
J§Q9 N034 N046 N049 MMBFJ201
Q11 N033 N037 0 0 MMBT2222A
R17 N029 N033 33k
R19 N022 N029 4.7k
Q12 N023 N026 0 0 MMBT2222A
R20 N020 N023 10k
R21 N015 N020 100k
R22 N037 N036 22k
Vcell2 N021 N028 3.2
Q13 N022 N020 N015 0 MMBT2907A
X§S5 N034 N029 N028 IRLB8721  ; pins D G S
R23 N026 VcON 22k
Rout2 N015 N021 1m
Q14 N027 N038 0 0 MMBT2222A
R24 N038 VcOFF 22k
R25 N015 N030 560k
X§S6 N034 N030 N015 irlml6402  ; pins D G S
Q15 N032 P003 0 0 MMBT2222A
R26 N025 N032 1k
R27 VcON P003 22k
D3 Vcc N025 D
Q16 N031 N035 0 0 MMBT2222A
R28 N024 N031 1k
R29 VcOFF N035 22k
D4 Vcc N024 D
R30 N030 N027 330k
X§M3 N036 VcON Vcc AO3401A  ; pins D G S
X§M4 N036 VcON 0 AO3400  ; pins D G S
J§Q17 N015 N027 N030 MMBFJ201
Q18 N014 N018 0 0 MMBT2222A
R31 N010 N014 33k
R32 N003 N010 4.7k
Q19 N004 N007 0 0 MMBT2222A
R33 N001 N004 10k
R34 out_2 N001 100k
R35 N018 N017 22k
Vcell3 N002 N009 3.2
Q20 N003 N001 out_2 0 MMBT2907A
X§S7 N015 N010 N009 IRLB8721  ; pins D G S
R36 N007 VcON 22k
Rout3 out_2 N002 1m
Q21 N008 N019 0 0 MMBT2222A
R37 N019 VcOFF 22k
R38 out_2 N011 560k
X§S8 N015 N011 out_2 irlml6402  ; pins D G S
Q22 N013 P004 0 0 MMBT2222A
R39 N006 N013 1k
R40 VcON P004 22k
D5 Vcc N006 D
Q23 N012 N016 0 0 MMBT2222A
R41 N005 N012 1k
R42 VcOFF N016 22k
D6 Vcc N005 D
R43 N011 N008 330k
X§M5 N017 VcON Vcc AO3401A  ; pins D G S
X§M6 N017 VcON 0 AO3400  ; pins D G S
J§Q24 out_2 N008 N011 MMBFJ201
.model D D
.lib standard.dio
.model NPN NPN
.model PNP PNP
.lib standard.bjt
.model NJF NJF
.model PJF PJF
.lib standard.jft
* .tran 0 40m 0 10u
.MODEL MMBT2222A  NPN (IS=25.4f NF=1.00 BF=274 VAF=114 IKF=0.121 ISE=14.3p NE=2.00 BR=4.00 NR=1.00 VAR=24.0 IKR=0.300 RE=0.219 RB=0.877 RC=87.7m XTB=1.5 CJE=27.6p VJE=1.10 MJE=0.500 CJC=14.2p VJC=0.300 MJC=0.300 TF=622p TR=124n EG=1.12)
.MODEL MMBT2907A  PNP (IS=60.7f NF=1.00 BF=312 VAF=139 IKF=0.219 ISE=26.0p NE=2.00 BR=4.00 NR=1.00 VAR=20.0 IKR=0.540 RE=85.8m RB=0.343 RC=34.3m XTB=1.5 CJE=50.4p VJE=1.10 MJE=0.500 CJC=23.1p VJC=0.300 MJC=0.300 TF=758p TR=123n EG=1.12)
.model AONS32304 VDMOS(Kp=239 Rs=0.42m Rd=1.2m Rg=3.0 Vto=2.16 VtoTc=-2.8m Bex=-2.07 mtriode=1.1 Ksubthres=0.1 Lambda=0.158 Cgdmax=1420p Cgdmin=288p Cgs=5352p tt=19n A=0.7 Is=2.35E-11 N=1.017 Eg=1.07 Rb=0.1m Trb1=-1 BV=33 IBV=250u M=0.456 Vj=0.56 Cjo=1090.0pF mfg=AOS Vds=30 Ron=1.8m Qg=40n)
.model MMBFJ201 NJF(BETA=0.000896 IS=3E-12 VTO=-0.794 LAMBDA=0.02 RD=0.001 RS=0.0013)
.inc AO3401A.sub
.inc IRLB8721.sub
.inc 1N4736A.sub
.inc FDMS6681Z.lib
.inc 1N4730A.sub
.model LED_RED D(Is=2e-9 N=2.2 Rs=10 Bv=5 Ibv=0.1 Cjo=20p M=0.4 Vj=0.65)
.inc irlml6402.spi
.include AO3400.lib
.include AO3401A.sub
.op
* .step param vcell 2.5 3.65 0.1
.step param vcell list 2.5 2.8 3.0 3.2 3.3 3.45 3.65
.backanno
.end